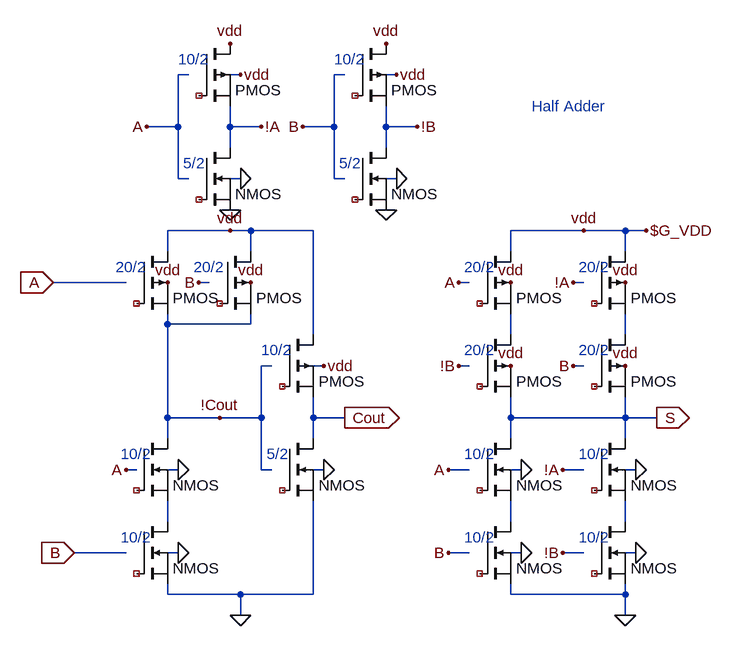
[diagram p0: schematic ha.asc]
ha.asc, the LTspice schematic file:
Version 4
SHEET 1 1208 1464
WIRE -48 -240 -64 -240
WIRE 32 -240 16 -240
WIRE 192 -240 176 -240
WIRE 272 -240 256 -240
WIRE -64 -160 -64 -240
WIRE -64 -160 -112 -160
WIRE 16 -160 16 -192
WIRE 64 -160 16 -160
WIRE 176 -160 176 -240
WIRE 176 -160 128 -160
WIRE 256 -160 256 -192
WIRE 304 -160 256 -160
WIRE 16 -128 16 -160
WIRE 256 -128 256 -160
WIRE -64 -80 -64 -160
WIRE -48 -80 -64 -80
WIRE 32 -80 16 -80
WIRE 176 -80 176 -160
WIRE 192 -80 176 -80
WIRE 272 -80 256 -80
WIRE 16 0 -80 0
WIRE 48 0 16 0
WIRE 144 0 48 0
WIRE 560 0 448 0
WIRE 624 0 560 0
WIRE 656 0 624 0
WIRE -80 32 -80 0
WIRE 48 32 48 0
WIRE 448 32 448 0
WIRE 624 32 624 0
WIRE -144 80 -256 80
WIRE -16 80 -32 80
WIRE 384 80 368 80
WIRE 560 80 544 80
WIRE -80 144 -80 128
WIRE 48 144 48 128
WIRE 48 144 -80 144
WIRE 144 160 144 0
WIRE 448 160 448 128
WIRE 624 160 624 128
WIRE 80 208 64 208
WIRE 160 208 144 208
WIRE 384 208 368 208
WIRE 560 208 544 208
WIRE -80 288 -80 144
WIRE 0 288 -80 288
WIRE 64 288 64 208
WIRE 64 288 0 288
WIRE 144 288 144 256
WIRE 192 288 144 288
WIRE 448 288 448 256
WIRE 624 288 624 256
WIRE 624 288 448 288
WIRE 672 288 624 288
WIRE -80 320 -80 288
WIRE 144 320 144 288
WIRE 448 320 448 288
WIRE 624 320 624 288
WIRE -128 368 -144 368
WIRE -64 368 -80 368
WIRE 64 368 64 288
WIRE 80 368 64 368
WIRE 160 368 144 368
WIRE 384 368 352 368
WIRE 464 368 448 368
WIRE 560 368 528 368
WIRE 640 368 624 368
WIRE -80 448 -80 416
WIRE 448 448 448 416
WIRE 624 448 624 416
WIRE -144 496 -224 496
WIRE -64 496 -80 496
WIRE 384 496 352 496
WIRE 464 496 448 496
WIRE 560 496 528 496
WIRE 640 496 624 496
WIRE -80 560 -80 544
WIRE 32 560 -80 560
WIRE 144 560 144 416
WIRE 144 560 32 560
WIRE 448 560 448 544
WIRE 624 560 624 544
WIRE 624 560 448 560
WIRE 32 592 32 560
WIRE 624 592 624 560
FLAG 352 496 B
FLAG 624 592 0
FLAG 368 80 A
FLAG 672 288 S
IOPIN 672 288 Out
FLAG 656 0 $G_VDD
FLAG -144 368 A
FLAG 32 592 0
FLAG -224 496 B
IOPIN -224 496 In
FLAG -256 80 A
IOPIN -256 80 In
FLAG -32 80 B
FLAG 192 288 Cout
IOPIN 192 288 Out
FLAG 0 288 !Cout
FLAG -64 368 0
FLAG -64 496 0
FLAG 160 368 0
FLAG 560 0 vdd
FLAG -80 80 vdd
FLAG 48 80 vdd
FLAG 160 208 vdd
FLAG 448 80 vdd
FLAG 352 368 A
FLAG 464 368 0
FLAG 464 496 0
FLAG 368 208 !B
FLAG 448 208 vdd
FLAG 544 80 !A
FLAG 624 80 vdd
FLAG 544 208 B
FLAG 624 208 vdd
FLAG 528 496 !B
FLAG 528 368 !A
FLAG 640 368 0
FLAG 640 496 0
FLAG 32 -80 0
FLAG 32 -240 vdd
FLAG 16 0 vdd
FLAG 16 -288 vdd
FLAG 16 -32 0
FLAG -112 -160 A
FLAG 64 -160 !A
FLAG 272 -80 0
FLAG 272 -240 vdd
FLAG 256 -288 vdd
FLAG 256 -32 0
FLAG 128 -160 B
FLAG 304 -160 !B
SYMBOL NMOS -128 320 R0
WINDOW 0 56 32 Invisible 2
SYMATTR InstName M17
SYMATTR Value NMOS
SYMATTR Value2 l=0.6u w=3u
SYMATTR SpiceModel ""
SYMBOL NMOS -128 448 R0
WINDOW 0 56 32 Invisible 2
SYMATTR InstName M19
SYMATTR Value NMOS
SYMATTR Value2 l=0.6u w=3u
SYMATTR SpiceModel ""
SYMBOL PMOS -128 32 R0
WINDOW 0 56 32 Invisible 2
SYMATTR InstName M28
SYMATTR Value PMOS
SYMATTR Value2 l=0.6u w=6u
SYMATTR SpiceModel ""
SYMBOL PMOS 0 32 R0
WINDOW 0 56 32 Invisible 2
SYMATTR InstName M29
SYMATTR Value PMOS
SYMATTR Value2 l=0.6u w=6u
SYMATTR SpiceModel ""
SYMBOL NMOS 96 320 R0
WINDOW 0 56 32 Invisible 2
SYMATTR InstName M31
SYMATTR Value NMOS
SYMATTR Value2 l=0.6u w=1.5u
SYMATTR SpiceModel ""
SYMBOL PMOS 96 160 R0
WINDOW 0 56 32 Invisible 2
SYMATTR InstName M32
SYMATTR Value PMOS
SYMATTR Value2 l=0.6u w=3u
SYMATTR SpiceModel ""
SYMBOL PMOS 400 32 R0
WINDOW 0 56 32 Invisible 2
SYMATTR InstName M12
SYMATTR Value PMOS
SYMATTR Value2 l=0.6u w=6u
SYMATTR SpiceModel ""
SYMBOL NMOS 400 448 R0
WINDOW 0 56 32 Invisible 2
SYMATTR InstName M1
SYMATTR Value NMOS
SYMATTR Value2 l=0.6u w=3u
SYMATTR SpiceModel ""
SYMBOL NMOS 400 320 R0
WINDOW 0 56 32 Invisible 2
SYMATTR InstName M3
SYMATTR Value NMOS
SYMATTR Value2 l=0.6u w=3u
SYMATTR SpiceModel ""
SYMBOL PMOS 400 160 R0
WINDOW 0 56 32 Invisible 2
SYMATTR InstName M2
SYMATTR Value PMOS
SYMATTR Value2 l=0.6u w=6u
SYMATTR SpiceModel ""
SYMBOL PMOS 576 32 R0
WINDOW 0 56 32 Invisible 2
SYMATTR InstName M4
SYMATTR Value PMOS
SYMATTR Value2 l=0.6u w=6u
SYMATTR SpiceModel ""
SYMBOL PMOS 576 160 R0
WINDOW 0 56 32 Invisible 2
SYMATTR InstName M5
SYMATTR Value PMOS
SYMATTR Value2 l=0.6u w=6u
SYMATTR SpiceModel ""
SYMBOL NMOS 576 448 R0
WINDOW 0 56 32 Invisible 2
SYMATTR InstName M6
SYMATTR Value NMOS
SYMATTR Value2 l=0.6u w=3u
SYMATTR SpiceModel ""
SYMBOL NMOS 576 320 R0
WINDOW 0 56 32 Invisible 2
SYMATTR InstName M7
SYMATTR Value NMOS
SYMATTR Value2 l=0.6u w=3u
SYMATTR SpiceModel ""
SYMBOL NMOS -32 -128 R0
WINDOW 0 56 32 Invisible 2
SYMATTR InstName M8
SYMATTR Value NMOS
SYMATTR Value2 l=0.6u w=1.5u
SYMATTR SpiceModel ""
SYMBOL PMOS -32 -288 R0
WINDOW 0 56 32 Invisible 2
SYMATTR InstName M9
SYMATTR Value PMOS
SYMATTR Value2 l=0.6u w=3u
SYMATTR SpiceModel ""
SYMBOL NMOS 208 -128 R0
WINDOW 0 56 32 Invisible 2
SYMATTR InstName M10
SYMATTR Value NMOS
SYMATTR Value2 l=0.6u w=1.5u
SYMATTR SpiceModel ""
SYMBOL PMOS 208 -288 R0
WINDOW 0 56 32 Invisible 2
SYMATTR InstName M11
SYMATTR Value PMOS
SYMATTR Value2 l=0.6u w=3u
SYMATTR SpiceModel ""
TEXT -40 56 Left 2 ;20/2
TEXT 64 184 Left 2 ;10/2
TEXT 72 344 Left 2 ;5/2
TEXT -160 56 Left 2 ;20/2
TEXT -152 344 Left 2 ;10/2
TEXT -152 472 Left 2 ;10/2
TEXT 376 56 Left 2 ;20/2
TEXT 376 344 Left 2 ;10/2
TEXT 376 472 Left 2 ;10/2
TEXT 376 184 Left 2 ;20/2
TEXT 552 56 Left 2 ;20/2
TEXT 552 184 Left 2 ;20/2
TEXT 552 344 Left 2 ;10/2
TEXT 552 472 Left 2 ;10/2
TEXT -64 -264 Left 2 ;10/2
TEXT -56 -104 Left 2 ;5/2
TEXT 176 -264 Left 2 ;10/2
TEXT 184 -104 Left 2 ;5/2
TEXT 480 -192 Left 2 ;Half Adder

The netlist it stands for:
* ha.asc
* M17: NMOS l=0.6u w=3u (symbol NMOS not certain, pin order unknown); nets seen at it: !Cout, N003
* M19: NMOS l=0.6u w=3u (symbol NMOS not certain, pin order unknown); nets seen at it: 0, N003
* M28: PMOS l=0.6u w=6u (symbol PMOS not certain, pin order unknown); nets seen at it: !Cout, vdd
* M29: PMOS l=0.6u w=6u (symbol PMOS not certain, pin order unknown); nets seen at it: !Cout, vdd
* M31: NMOS l=0.6u w=1.5u (symbol NMOS not certain, pin order unknown); nets seen at it: 0, Cout
* M32: PMOS l=0.6u w=3u (symbol PMOS not certain, pin order unknown); nets seen at it: Cout, vdd
* M12: PMOS l=0.6u w=6u (symbol PMOS not certain, pin order unknown); nets seen at it: N001, vdd
* M1: NMOS l=0.6u w=3u (symbol NMOS not certain, pin order unknown); nets seen at it: 0, N004
* M3: NMOS l=0.6u w=3u (symbol NMOS not certain, pin order unknown); nets seen at it: N004, S
* M2: PMOS l=0.6u w=6u (symbol PMOS not certain, pin order unknown); nets seen at it: N001, S
* M4: PMOS l=0.6u w=6u (symbol PMOS not certain, pin order unknown); nets seen at it: N002, vdd
* M5: PMOS l=0.6u w=6u (symbol PMOS not certain, pin order unknown); nets seen at it: N002, S
* M6: NMOS l=0.6u w=3u (symbol NMOS not certain, pin order unknown); nets seen at it: 0, N005
* M7: NMOS l=0.6u w=3u (symbol NMOS not certain, pin order unknown); nets seen at it: N005, S
* M8: NMOS l=0.6u w=1.5u (symbol NMOS not certain, pin order unknown); nets seen at it: !A, 0
* M9: PMOS l=0.6u w=3u (symbol PMOS not certain, pin order unknown); nets seen at it: !A, vdd
* M10: NMOS l=0.6u w=1.5u (symbol NMOS not certain, pin order unknown); nets seen at it: !B, 0
* M11: PMOS l=0.6u w=3u (symbol PMOS not certain, pin order unknown); nets seen at it: !B, vdd
* 20/2
* 10/2
* 5/2
* 20/2
* 10/2
* 10/2
* 20/2
* 10/2
* 10/2
* 20/2
* 20/2
* 20/2
* 10/2
* 10/2
* 10/2
* 5/2
* 10/2
* 5/2
* Half Adder
.backanno
.end